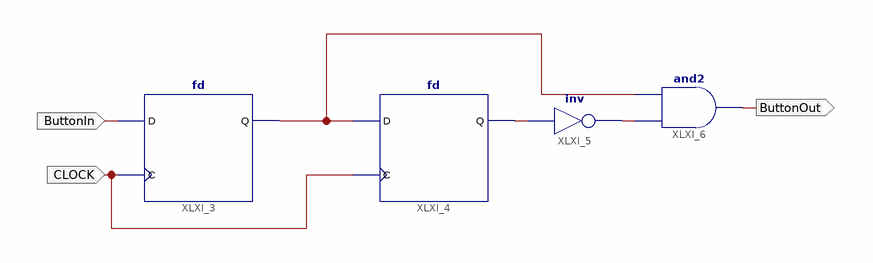
[diagram p0: schematic sheet 1]
// Xilinx ISE schematic ButtonPulser.sch (spartan6) as structural Verilog: 4 symbols, 3 ports
module ButtonPulser (
  input  ButtonIn,
  input  CLOCK,
  output ButtonOut
);

  wire XLXN_3, XLXN_4, XLXN_5;

  fd XLXI_3 (.C(CLOCK), .D(ButtonIn), .Q(XLXN_3));
  fd XLXI_4 (.C(CLOCK), .D(XLXN_3), .Q(XLXN_4));
  not XLXI_5 (XLXN_5, XLXN_4);
  and XLXI_6 (ButtonOut, XLXN_5, XLXN_3);
endmodule
